# EAGLE schematic extension_board_0_1 (EAGLE 6.5.0)

## Sheet 1 of 4: Header
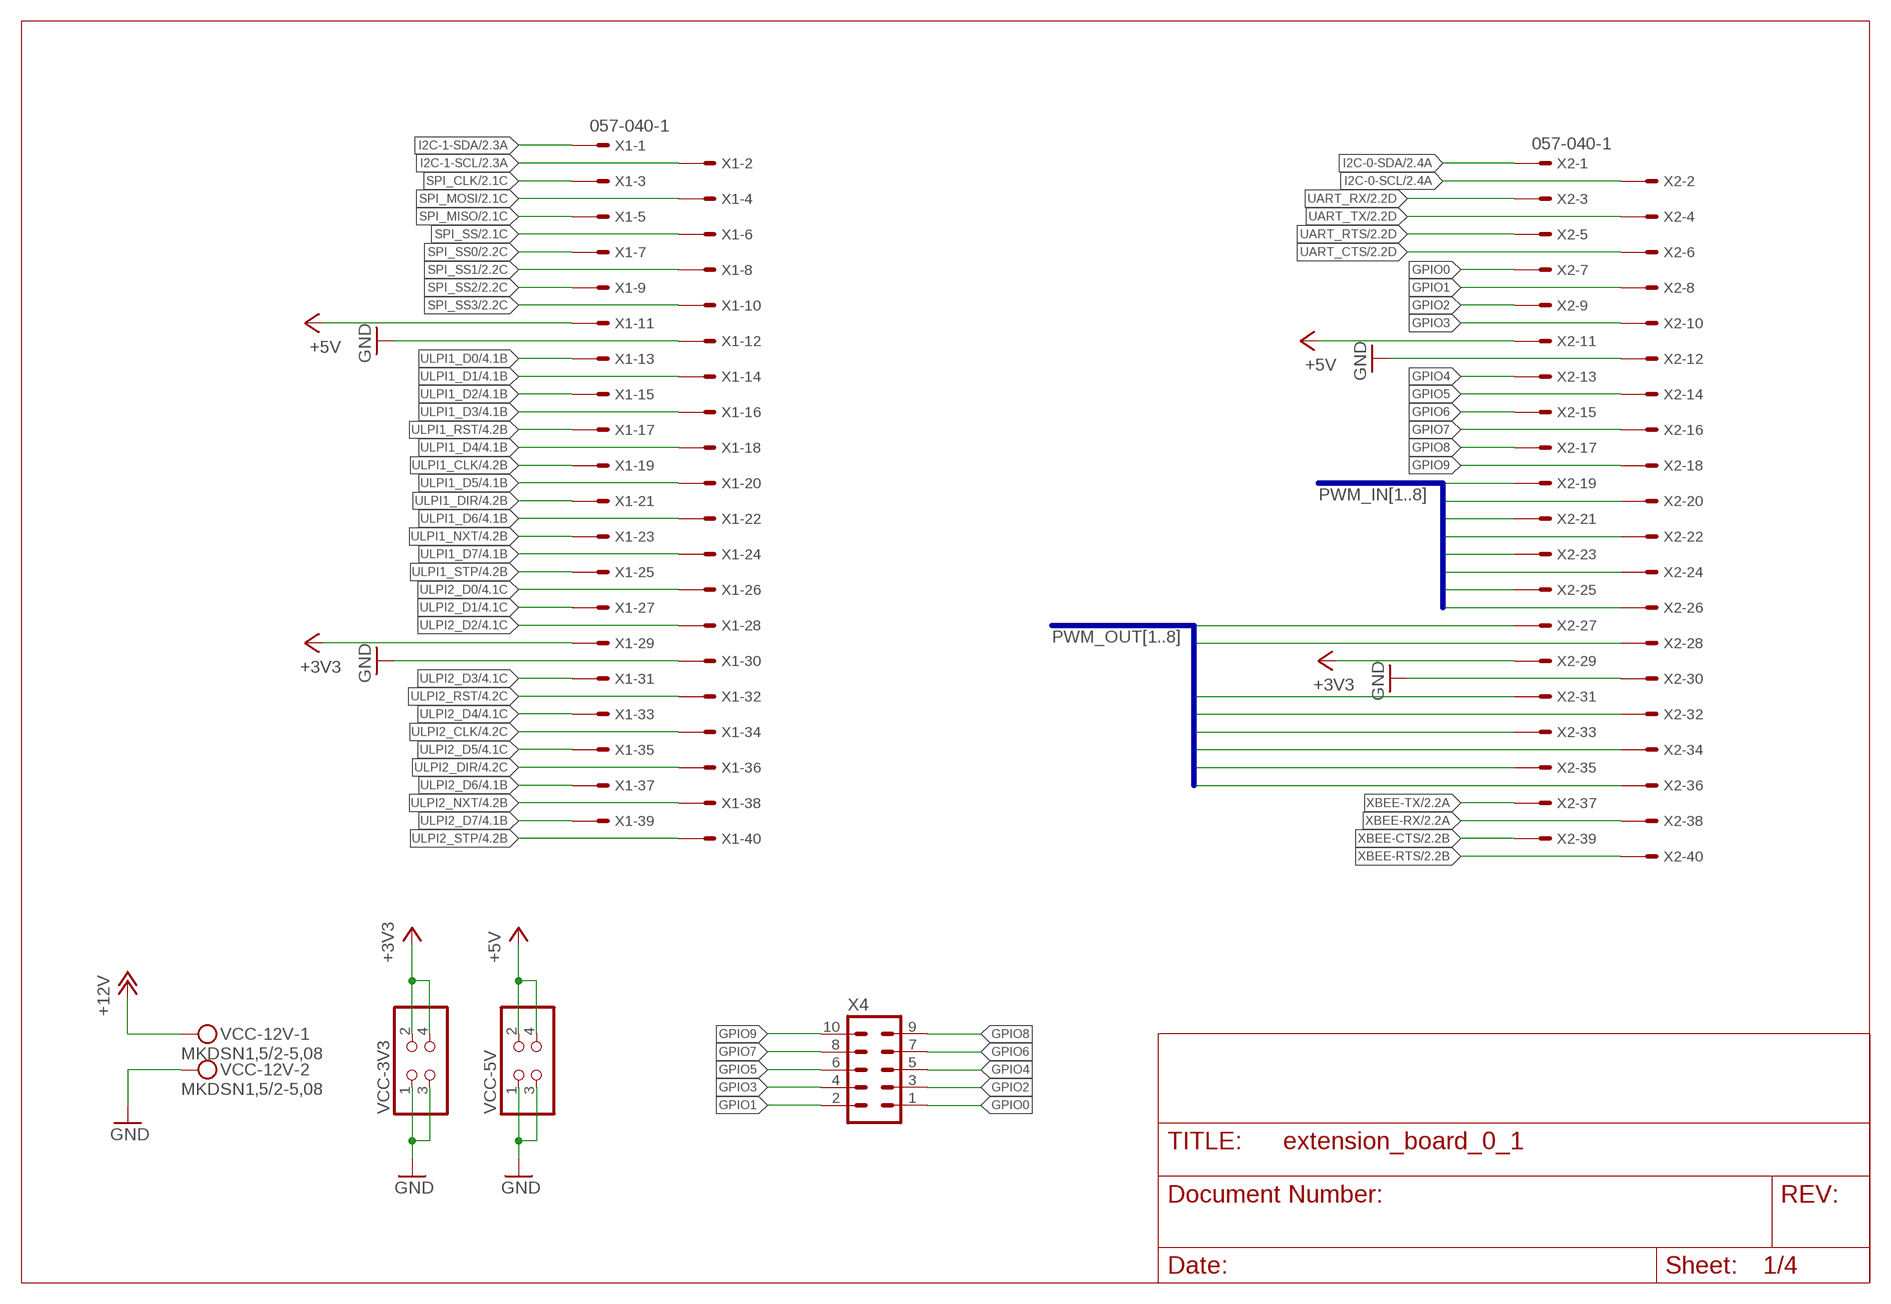
[diagram p0: schematic, sheet 1]

### Parts
VCC-3V3  PINHD-2X2  [2X02]
VCC-5V  PINHD-2X2  [2X02]
VCC-12V  MKDSN1,5/2-5,08  [MKDSN1,5/2-5,08]
X1  057-040-1  [057-040-1]
X2  057-040-1  [057-040-1]
X4  MA05-2  [MA05-2]

### Nets
+3V3: VCC-3V3.2 VCC-3V3.4 X1.29 X2.29 ; also sheet 2,4
+5V: VCC-5V.2 VCC-5V.4 X1.11 X2.11 ; also sheet 2,4
+12V: VCC-12V.1 ; also sheet 3
GND: VCC-3V3.1 VCC-3V3.3 VCC-5V.1 VCC-5V.3 VCC-12V.2 X1.12 X1.30 X2.12 X2.30 ; also sheet 2,3,4
GPIO0: X2.7 X4.1
GPIO1: X2.8 X4.2
GPIO2: X2.9 X4.3
GPIO3: X2.10 X4.4
GPIO4: X2.13 X4.5
GPIO5: X2.14 X4.6
GPIO6: X2.15 X4.7
GPIO7: X2.16 X4.8
GPIO8: X2.17 X4.9
GPIO9: X2.18 X4.10
I2C-0-SCL: X2.2 ; also sheet 2
I2C-0-SDA: X2.1 ; also sheet 2
I2C-1-SCL: X1.2 ; also sheet 2
I2C-1-SDA: X1.1 ; also sheet 2
PWM_IN1: X2.19 ; also sheet 2
PWM_IN2: X2.20 ; also sheet 2
PWM_IN3: X2.21 ; also sheet 2
PWM_IN4: X2.22 ; also sheet 2
PWM_IN5: X2.23 ; also sheet 2
PWM_IN6: X2.24 ; also sheet 2
PWM_IN7: X2.25 ; also sheet 2
PWM_IN8: X2.26 ; also sheet 2
PWM_OUT1: X2.27 ; also sheet 2
PWM_OUT2: X2.28 ; also sheet 2
PWM_OUT3: X2.31 ; also sheet 2
PWM_OUT4: X2.32 ; also sheet 2
PWM_OUT5: X2.33 ; also sheet 2
PWM_OUT6: X2.34 ; also sheet 2
PWM_OUT7: X2.35 ; also sheet 2
PWM_OUT8: X2.36 ; also sheet 2
SPI_CLK: X1.3 ; also sheet 2
SPI_MISO: X1.5 ; also sheet 2
SPI_MOSI: X1.4 ; also sheet 2
SPI_SS: X1.6 ; also sheet 2
SPI_SS0: X1.7 ; also sheet 2
SPI_SS1: X1.8 ; also sheet 2
SPI_SS2: X1.9 ; also sheet 2
SPI_SS3: X1.10 ; also sheet 2
UART_CTS: X2.6 ; also sheet 2
UART_RTS: X2.5 ; also sheet 2
UART_RX: X2.3 ; also sheet 2
UART_TX: X2.4 ; also sheet 2
ULPI1_CLK: X1.19 ; also sheet 4
ULPI1_D0: X1.13 ; also sheet 4
ULPI1_D1: X1.14 ; also sheet 4
ULPI1_D2: X1.15 ; also sheet 4
ULPI1_D3: X1.16 ; also sheet 4
ULPI1_D4: X1.18 ; also sheet 4
ULPI1_D5: X1.20 ; also sheet 4
ULPI1_D6: X1.22 ; also sheet 4
ULPI1_D7: X1.24 ; also sheet 4
ULPI1_DIR: X1.21 ; also sheet 4
ULPI1_NXT: X1.23 ; also sheet 4
ULPI1_RST: X1.17 ; also sheet 4
ULPI1_STP: X1.25 ; also sheet 4
ULPI2_CLK: X1.34 ; also sheet 4
ULPI2_D0: X1.26 ; also sheet 4
ULPI2_D1: X1.27 ; also sheet 4
ULPI2_D2: X1.28 ; also sheet 4
ULPI2_D3: X1.31 ; also sheet 4
ULPI2_D4: X1.33 ; also sheet 4
ULPI2_D5: X1.35 ; also sheet 4
ULPI2_D6: X1.37 ; also sheet 4
ULPI2_D7: X1.39 ; also sheet 4
ULPI2_DIR: X1.36 ; also sheet 4
ULPI2_NXT: X1.38 ; also sheet 4
ULPI2_RST: X1.32 ; also sheet 4
ULPI2_STP: X1.40 ; also sheet 4
XBEE-CTS: X2.39 ; also sheet 2
XBEE-RTS: X2.40 ; also sheet 2
XBEE-RX: X2.38 ; also sheet 2
XBEE-TX: X2.37 ; also sheet 2

### Buses
PWM_IN[1..8]
PWM_OUT[1..8]

## Sheet 2 of 4: Interfaces
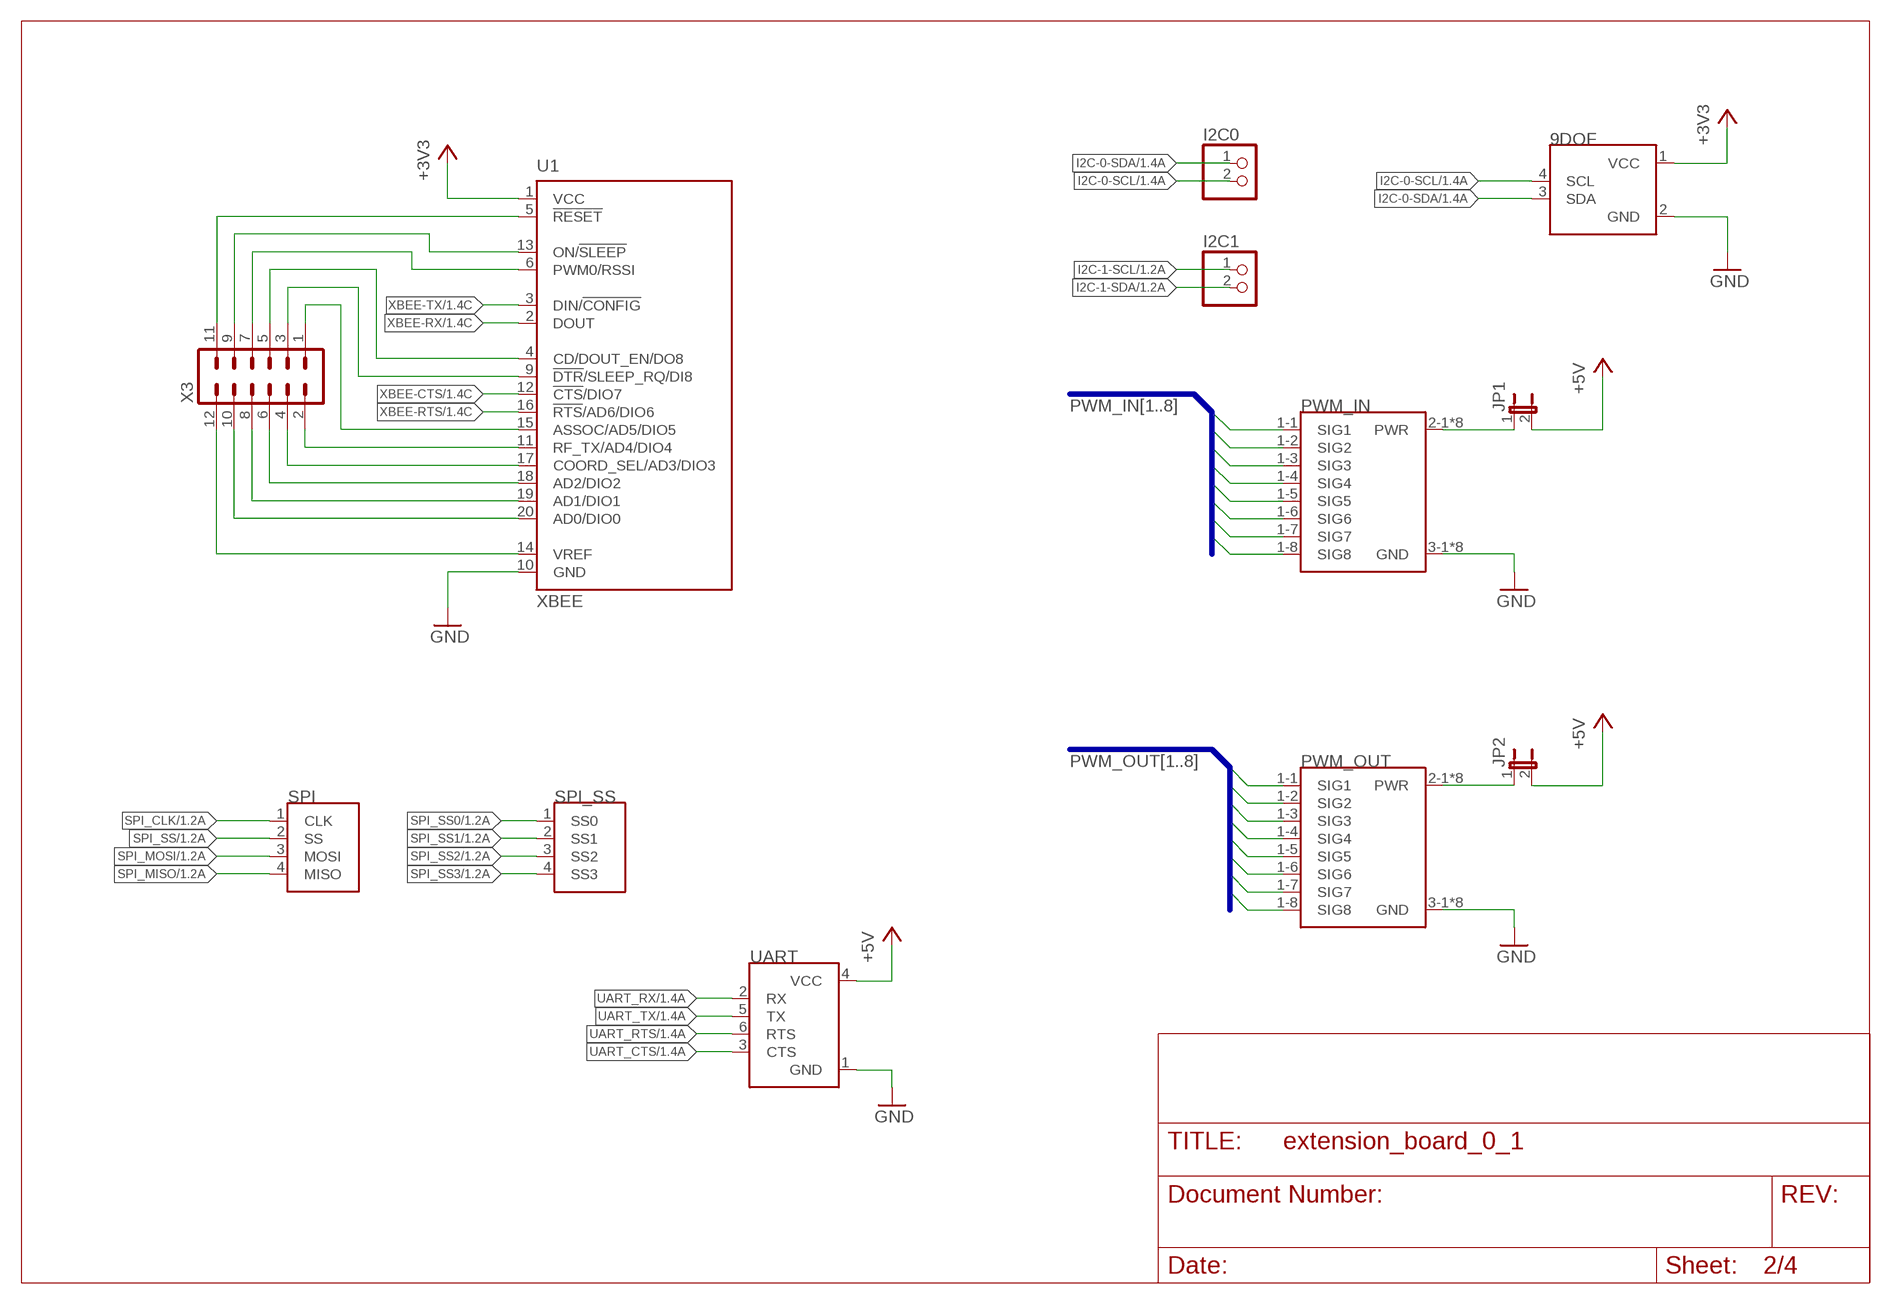
[diagram p1: schematic, sheet 2]

### Parts
9DOF  I2C  [MA04-1]
I2C0  PINHD-1X2  [1X02]
I2C1  PINHD-1X2  [1X02]
JP1  JP1E  [JP1]
JP2  JP1E  [JP1]
PWM_IN  8RX  [MA08-3]
PWM_OUT  8RX  [MA08-3]
SPI  SPI_MAIN  [MA04-1]
SPI_SS  SPI_SS  [MA04-1]
U1  XBEE  [XBEE]
UART  UART  [MA03-2]
X3  MA06-2  [MA06-2]

### Nets
+3V3: 9DOF.1(VCC) U1.1(VCC) ; also sheet 1,4
+5V: JP1.2 JP2.2 UART.4(VCC) ; also sheet 1,4
GND: 9DOF.2(GND) PWM_IN.3-1(GND) PWM_IN.3-2(GND) PWM_IN.3-3(GND) PWM_IN.3-4(GND) PWM_IN.3-5(GND) PWM_IN.3-6(GND) PWM_IN.3-7(GND) PWM_IN.3-8(GND) PWM_OUT.3-1(GND) PWM_OUT.3-2(GND) PWM_OUT.3-3(GND) PWM_OUT.3-4(GND) PWM_OUT.3-5(GND) PWM_OUT.3-6(GND) PWM_OUT.3-7(GND) PWM_OUT.3-8(GND) U1.10(GND) UART.1(GND) ; also sheet 1,3,4
I2C-0-SCL: 9DOF.4(SCL) I2C0.2 ; also sheet 1
I2C-0-SDA: 9DOF.3(SDA) I2C0.1 ; also sheet 1
I2C-1-SCL: I2C1.1 ; also sheet 1
I2C-1-SDA: I2C1.2 ; also sheet 1
N$11: JP1.1 PWM_IN.2-1(PWR) PWM_IN.2-2(PWR) PWM_IN.2-3(PWR) PWM_IN.2-4(PWR) PWM_IN.2-5(PWR) PWM_IN.2-6(PWR) PWM_IN.2-7(PWR) PWM_IN.2-8(PWR)
N$12: JP2.1 PWM_OUT.2-1(PWR) PWM_OUT.2-2(PWR) PWM_OUT.2-3(PWR) PWM_OUT.2-4(PWR) PWM_OUT.2-5(PWR) PWM_OUT.2-6(PWR) PWM_OUT.2-7(PWR) PWM_OUT.2-8(PWR)
N$23: U1.5(!RESET) X3.11
N$24: U1.14(VREF) X3.12
N$25: U1.20(AD0/DIO0) X3.10
N$26: U1.19(AD1/DIO1) X3.8
N$27: U1.18(AD2/DIO2) X3.6
N$28: U1.17(COORD_SEL/AD3/DIO3) X3.4
N$29: U1.11(RF_TX/AD4/DIO4) X3.2
N$30: U1.15(ASSOC/AD5/DIO5) X3.1
N$31: U1.9(!DTR!/SLEEP_RQ/DI8) X3.3
N$32: U1.4(CD/DOUT_EN/DO8) X3.5
N$33: U1.6(PWM0/RSSI) X3.7
N$34: U1.13(ON/!SLEEP) X3.9
PWM_IN1: PWM_IN.1-1(SIG1) ; also sheet 1
PWM_IN2: PWM_IN.1-2(SIG2) ; also sheet 1
PWM_IN3: PWM_IN.1-3(SIG3) ; also sheet 1
PWM_IN4: PWM_IN.1-4(SIG4) ; also sheet 1
PWM_IN5: PWM_IN.1-5(SIG5) ; also sheet 1
PWM_IN6: PWM_IN.1-6(SIG6) ; also sheet 1
PWM_IN7: PWM_IN.1-7(SIG7) ; also sheet 1
PWM_IN8: PWM_IN.1-8(SIG8) ; also sheet 1
PWM_OUT1: PWM_OUT.1-1(SIG1) ; also sheet 1
PWM_OUT2: PWM_OUT.1-2(SIG2) ; also sheet 1
PWM_OUT3: PWM_OUT.1-3(SIG3) ; also sheet 1
PWM_OUT4: PWM_OUT.1-4(SIG4) ; also sheet 1
PWM_OUT5: PWM_OUT.1-5(SIG5) ; also sheet 1
PWM_OUT6: PWM_OUT.1-6(SIG6) ; also sheet 1
PWM_OUT7: PWM_OUT.1-7(SIG7) ; also sheet 1
PWM_OUT8: PWM_OUT.1-8(SIG8) ; also sheet 1
SPI_CLK: SPI.1(CLK) ; also sheet 1
SPI_MISO: SPI.4(MISO) ; also sheet 1
SPI_MOSI: SPI.3(MOSI) ; also sheet 1
SPI_SS: SPI.2(SS) ; also sheet 1
SPI_SS0: SPI_SS.1(SS0) ; also sheet 1
SPI_SS1: SPI_SS.2(SS1) ; also sheet 1
SPI_SS2: SPI_SS.3(SS2) ; also sheet 1
SPI_SS3: SPI_SS.4(SS3) ; also sheet 1
UART_CTS: UART.3(CTS) ; also sheet 1
UART_RTS: UART.6(RTS) ; also sheet 1
UART_RX: UART.2(RX) ; also sheet 1
UART_TX: UART.5(TX) ; also sheet 1
XBEE-CTS: U1.12(!CTS!/DIO7) ; also sheet 1
XBEE-RTS: U1.16(!RTS!/AD6/DIO6) ; also sheet 1
XBEE-RX: U1.2(DOUT) ; also sheet 1
XBEE-TX: U1.3(DIN/!CONFIG) ; also sheet 1

### Buses
PWM_IN[1..8]
PWM_OUT[1..8]

## Sheet 3 of 4: power supply
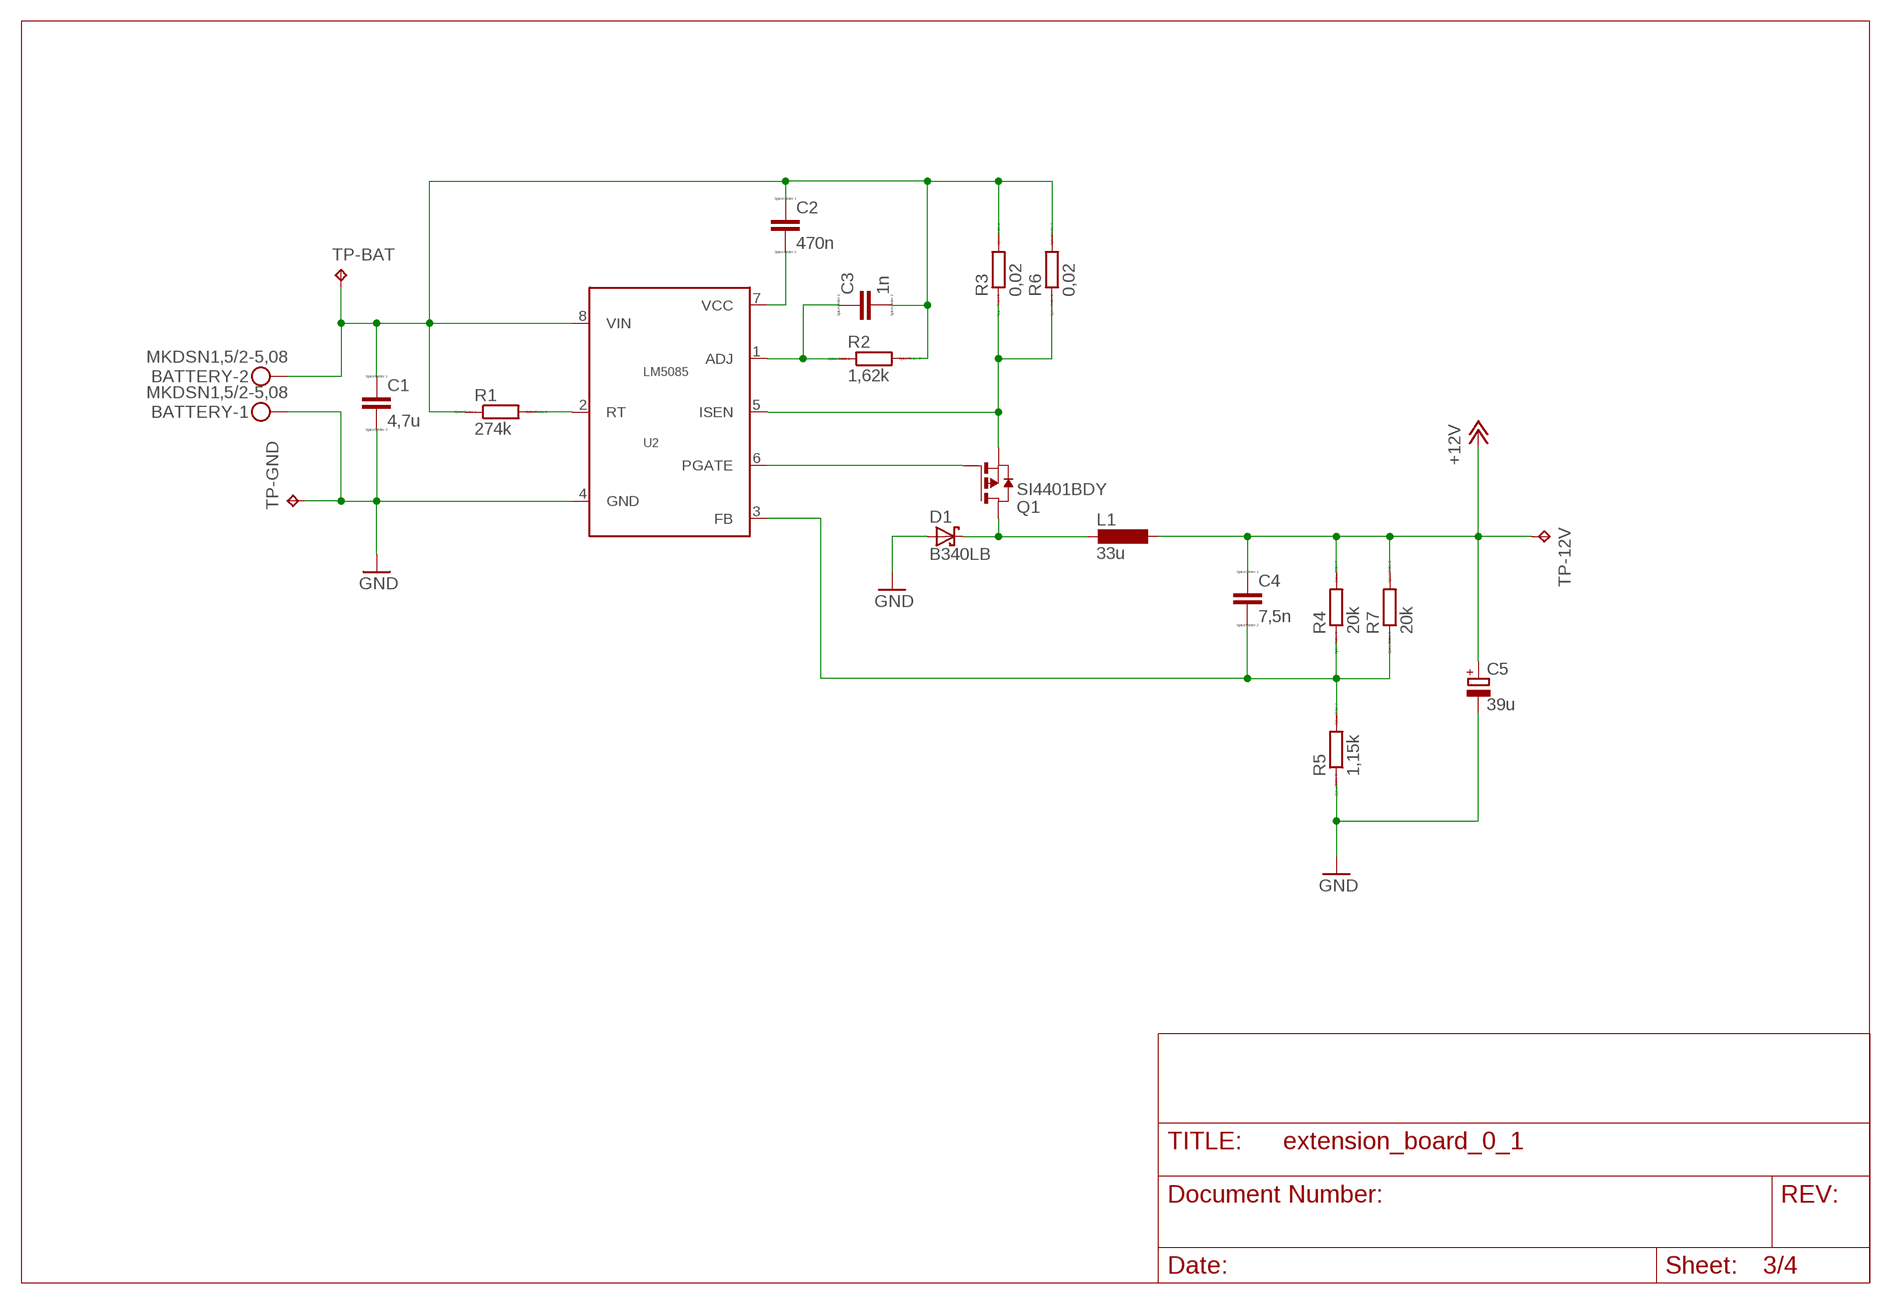
[diagram p2: schematic, sheet 3]

### Parts
BATTERY  MKDSN1,5/2-5,08  [MKDSN1,5/2-5,08]
C1  4,7u  CC1206  [C1206]
C2  470n  CC1206  [C1206]
C3  1n  CC1206  [C1206]
C4  7,5n  CC1206  [C1206]
C5  39u  CPOL-EUSMCB  [SMC_B]
D1  B340LB  [SMB]
L1  33u  MSS1210  [INDUKTOR]
Q1  SI4401BDY  [SO8-FET]
R1  274k  RR1206  [R1206]
R2  1,62k  RR1206  [R1206]
R3  0,02  RR1206  [R1206]
R4  20k  RR1206  [R1206]
R5  1,15k  RR1206  [R1206]
R6  0,02  RR1206  [R1206]
R7  20k  RR1206  [R1206]
TP-12V  TPPAD1-13  [P1-13]
TP-BAT  TPPAD1-13  [P1-13]
TP-GND  TPPAD1-13  [P1-13]
U2  LM5085  [S-PDSO-G08]

### Nets
+12V: C4.1 C5.+ L1.P$2 R4.2 R7.2 TP-12V.TP ; also sheet 1
GND: BATTERY.1 C1.2 C5.- D1.A R5.1 TP-GND.TP U2.4(GND) ; also sheet 1,2,4
N$3: R1.2 U2.2(RT)
N$4: C2.2 U2.7(VCC)
N$5: C3.1 R2.1 U2.1(ADJ)
N$6: BATTERY.2 C1.1 C2.1 C3.2 R1.1 R2.2 R3.2 R6.2 TP-BAT.TP U2.8(VIN)
N$7: Q1.1(S) Q1.2(S) Q1.3(S) R3.1 R6.1 U2.5(ISEN)
N$8: C4.2 R4.1 R5.2 R7.1 U2.3(FB)
N$9: Q1.4(G) U2.6(PGATE)
N$10: D1.C L1.P$1 Q1.5(D) Q1.6(D) Q1.7(D) Q1.8(D) Q1.D1(D) Q1.D2(D) Q1.D3(D)

## Sheet 4 of 4: USB
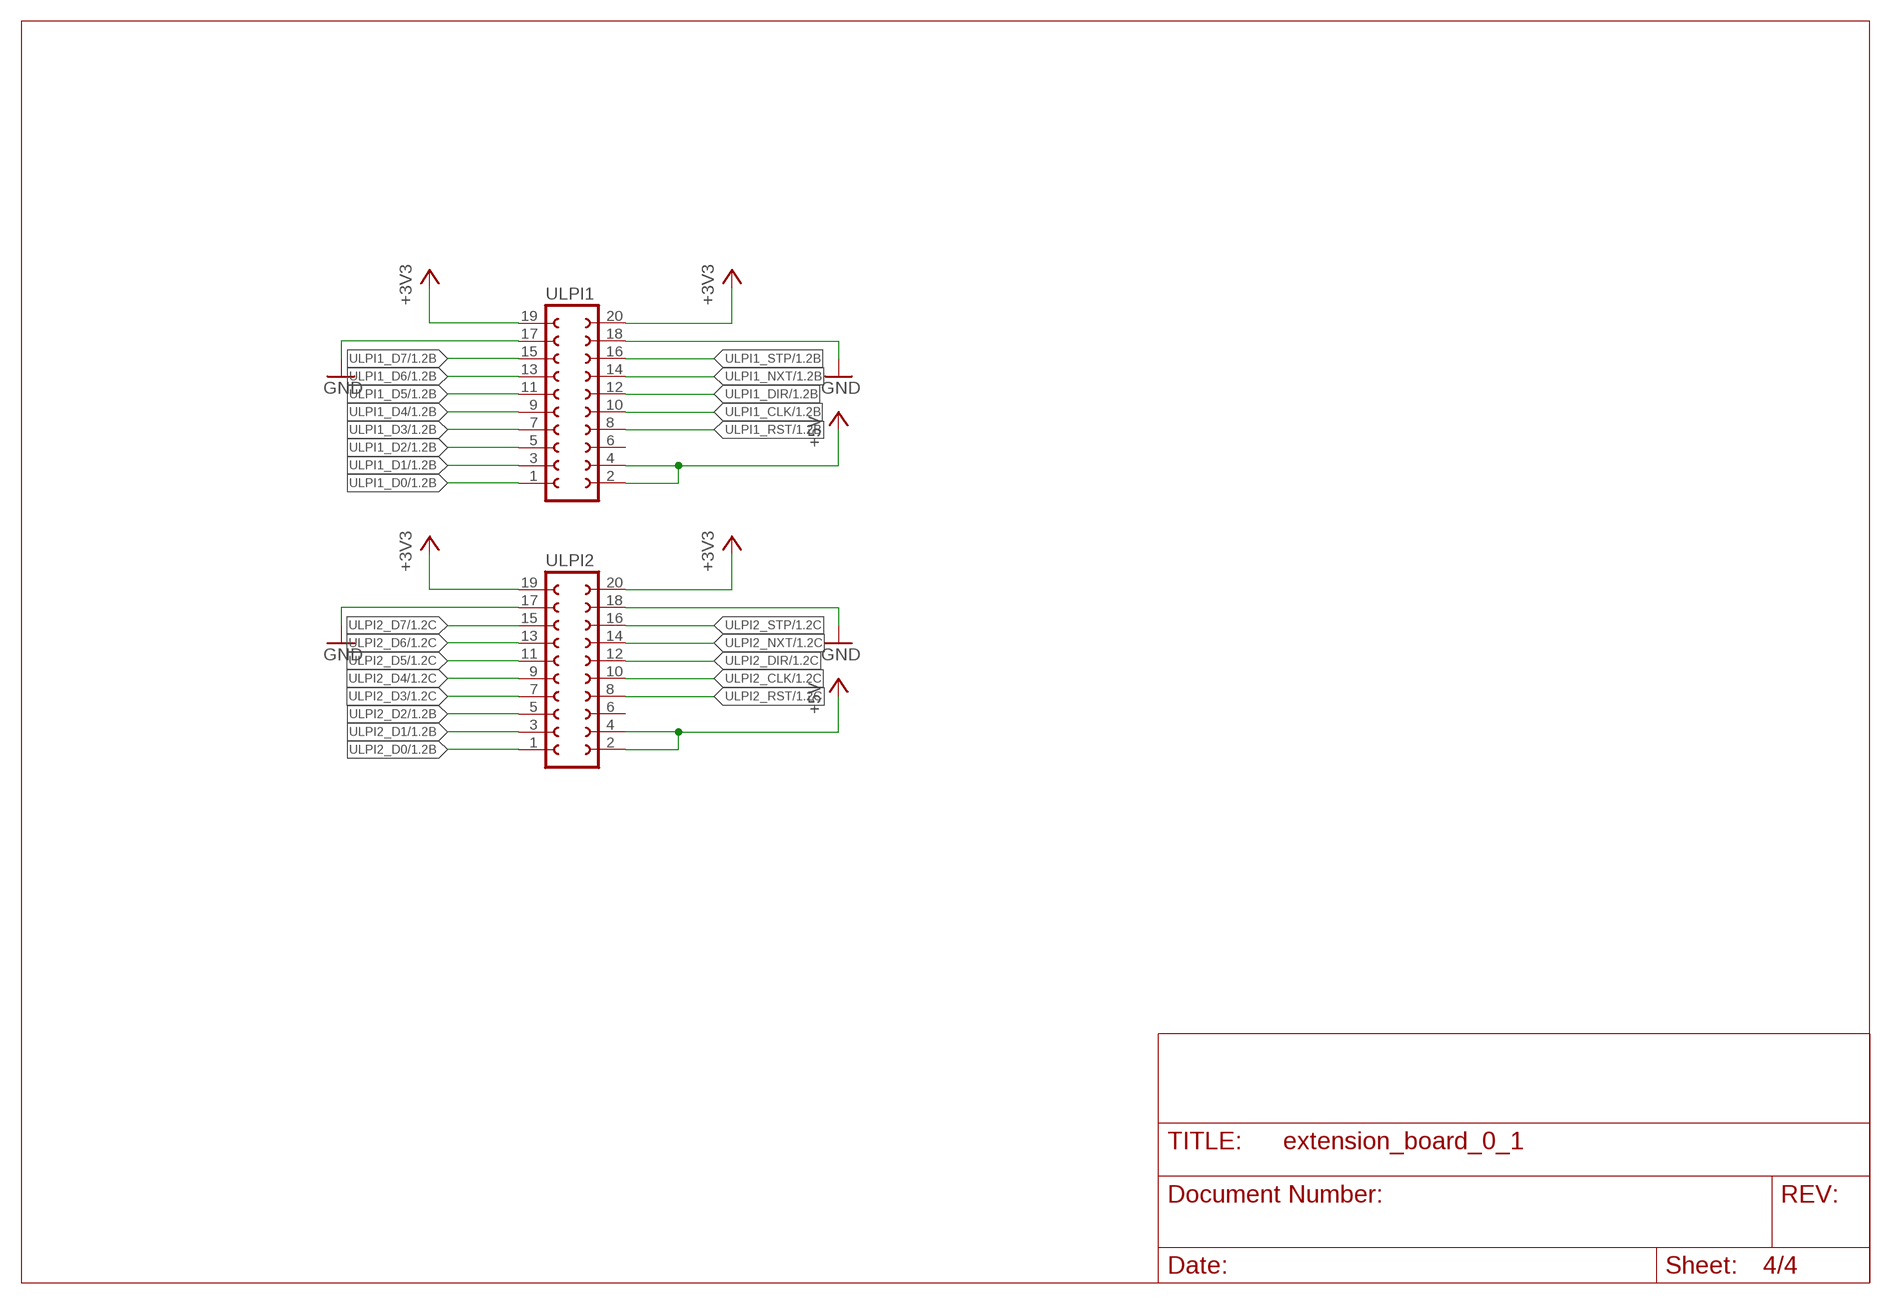
[diagram p3: schematic, sheet 4]

### Parts
ULPI1  FE10-2W  [FE10-2W]
ULPI2  FE10-2W  [FE10-2W]

### Nets
+3V3: ULPI1.19 ULPI1.20 ULPI2.19 ULPI2.20 ; also sheet 1,2
+5V: ULPI1.2 ULPI1.4 ULPI2.2 ULPI2.4 ; also sheet 1,2
GND: ULPI1.17 ULPI1.18 ULPI2.17 ULPI2.18 ; also sheet 1,2,3
ULPI1_CLK: ULPI1.10 ; also sheet 1
ULPI1_D0: ULPI1.1 ; also sheet 1
ULPI1_D1: ULPI1.3 ; also sheet 1
ULPI1_D2: ULPI1.5 ; also sheet 1
ULPI1_D3: ULPI1.7 ; also sheet 1
ULPI1_D4: ULPI1.9 ; also sheet 1
ULPI1_D5: ULPI1.11 ; also sheet 1
ULPI1_D6: ULPI1.13 ; also sheet 1
ULPI1_D7: ULPI1.15 ; also sheet 1
ULPI1_DIR: ULPI1.12 ; also sheet 1
ULPI1_NXT: ULPI1.14 ; also sheet 1
ULPI1_RST: ULPI1.8 ; also sheet 1
ULPI1_STP: ULPI1.16 ; also sheet 1
ULPI2_CLK: ULPI2.10 ; also sheet 1
ULPI2_D0: ULPI2.1 ; also sheet 1
ULPI2_D1: ULPI2.3 ; also sheet 1
ULPI2_D2: ULPI2.5 ; also sheet 1
ULPI2_D3: ULPI2.7 ; also sheet 1
ULPI2_D4: ULPI2.9 ; also sheet 1
ULPI2_D5: ULPI2.11 ; also sheet 1
ULPI2_D6: ULPI2.13 ; also sheet 1
ULPI2_D7: ULPI2.15 ; also sheet 1
ULPI2_DIR: ULPI2.12 ; also sheet 1
ULPI2_NXT: ULPI2.14 ; also sheet 1
ULPI2_RST: ULPI2.8 ; also sheet 1
ULPI2_STP: ULPI2.16 ; also sheet 1
Unconnected: ULPI1.6 ULPI2.6

## Library data of the parts
9DOF = multicopter:I2C
BATTERY VCC-12V = con-phoenix-508:MKDSN1,5/2-5,08: MKDSN 1,5/ 2-5,08 Printklemme Nennstrom: 13,5 A Nennspannung: 250 V Rastermaß: 5,08 mm Polzahl: 2 Anschlussart: Schraubanschluss Montage: Löten Anschlussrichtung Leiter/Platine: 0 ° Artikelnummer: 1729128 Source: http://eshop.phoenixcontact.com .. 1729128.pdf; MPN: MKDSN 1,5/2-5.08; OC_FARNELL: 1792903; OC_NEWARK: 30M2397
C1-C4 = eagle-ltspice:C: CAPACITOR, European symbol; SPICEMODEL: NONE; SPICEPREFIX: C
C5 = resistor:CPOL-EU: POLARIZED CAPACITOR, European symbol
D1 = multicopter:B340L: Silicon Schottky Diodes General-purpose diode for high-speed switching
I2C0 I2C1 = pinhead:PINHD-1X2: PIN HEADER
JP1 JP2 = jumper:JP1E: JUMPER
L1 = multicopter:MSS1210
PWM_IN PWM_OUT = multicopter:8RX
Q1 = probox-parts:SI4401BDY
R1-R7 = eagle-ltspice:R: RESISTOR, European symbol; SPICEMODEL: NONE; SPICEPREFIX: R
SPI = multicopter:SPI_MAIN
SPI_SS = multicopter:SPI_SS
TP-12V TP-BAT TP-GND = testpad:TP: Test pad
U1 = maxstream:XBEE: XBee (TM) /XBee-PRO(TM) OEM RF Modules Source: MaxStream, Inc. xbee_productmanual.pdf; MPN: XBP24-Z7UIT-004; OC_FARNELL: 1751799; OC_NEWARK: 34R5507
U2 = multicopter:LM5085: LM5085 http://www.ti.com/lit/ds/symlink/lm5085.pdf
UART = multicopter:UART
ULPI1 ULPI2 = multicopter:FE10-2W: FEMALE HEADER; OC_FARNELL: unknown; OC_NEWARK: unknown
VCC-3V3 VCC-5V = pinhead:PINHD-2X2: PIN HEADER
X1 X2 = con-panduit:057-040-: CONNECTOR 40-pin series 057 contact pc board low profile headers; OC_FARNELL: unknown; OC_NEWARK: unknown
X3 = con-lstb:MA06-2: PIN HEADER; OC_FARNELL: unknown; OC_NEWARK: unknown
X4 = con-lstb:MA05-2: PIN HEADER; OC_FARNELL: unknown; OC_NEWARK: unknown